# Altium schematic sheet Telephone Line Emulator.SchDoc: Telephone Line Emulator
size A4; Title2: NASCO ALARM INTERFACE
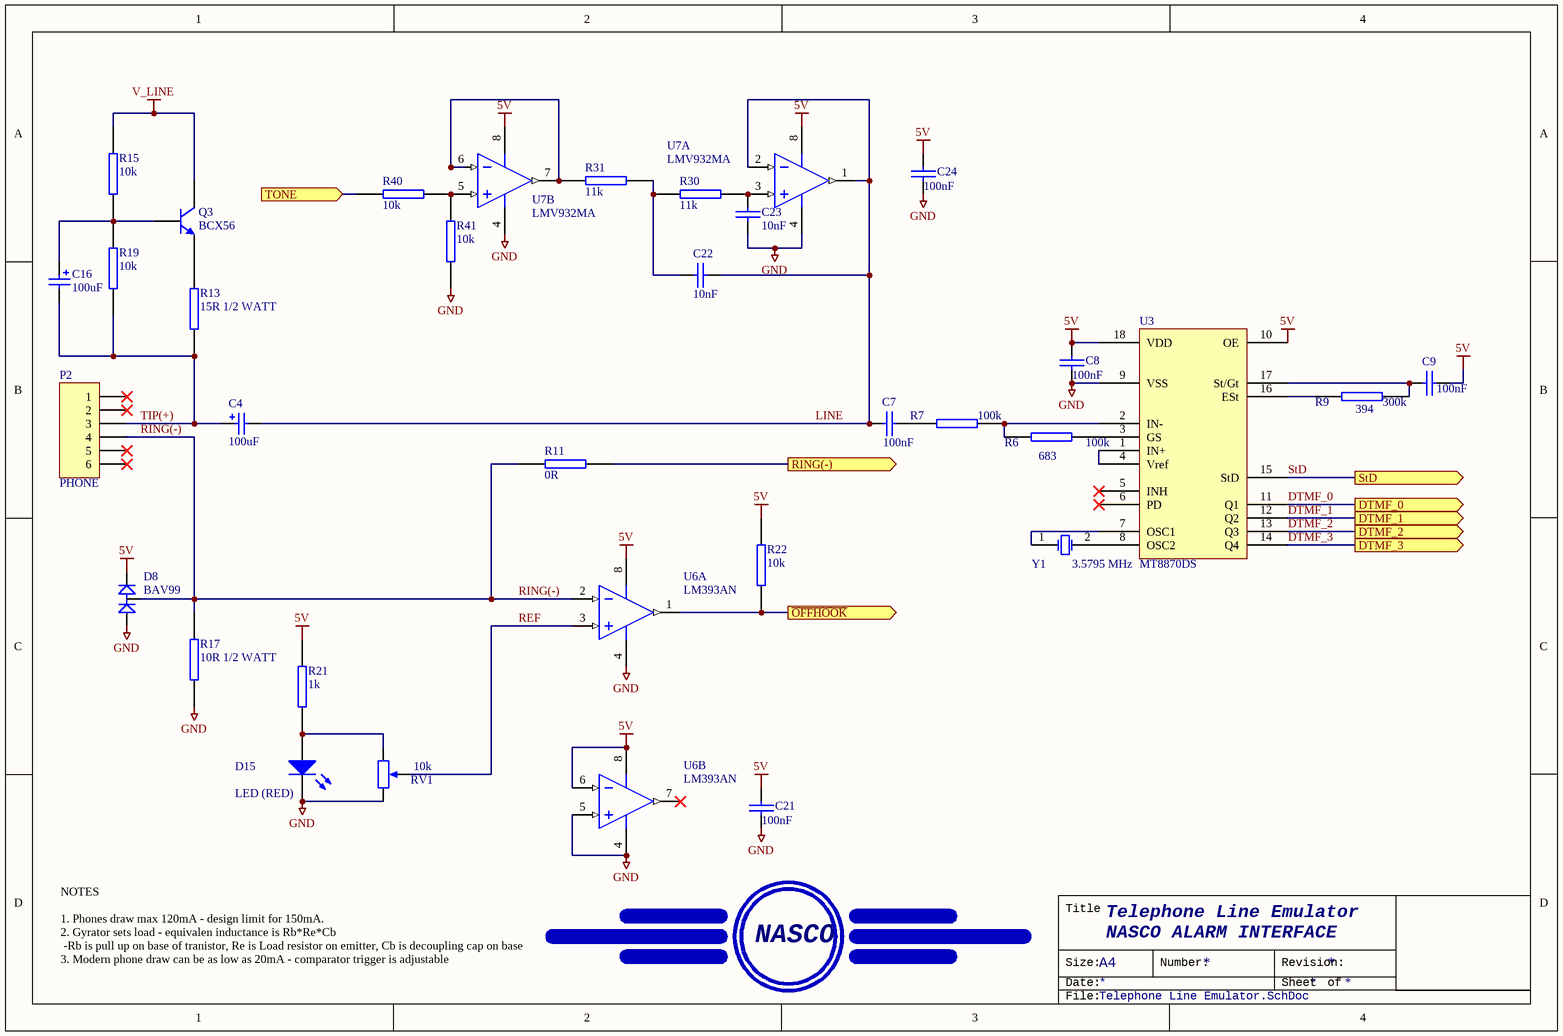
[diagram p0: Telephone Line Emulator.SchDoc]

## Parts
?  (no value)  (no BOM)
C4  100uF  [CAP ELECTRO SIZE-E]
C7  100nF  [CAP (3D) - 0603]
C8  100nF  [CAP (3D) - 0603]
C9  100nF  [CAP (3D) - 0603]
C16  100uF  [CAP ELECTRO SIZE-E]
C21  100nF  [CAP (3D) - 0603]
C22  10nF  [CAP (3D) - 0603]
C23  10nF  [CAP (3D) - 0603]
C24  100nF  [CAP (3D) - 0603]
D8  BAV99  [SOT23-3L]
D15  LED (RED)  [LED 3MM]
P2  PHONE  [MOLEXZ RJ11]
Q3  BCX56  [SOT89]
R6  100k  [RES (3D) - 0603]
R7  100k  [RES (3D) - 0603]
R9  300k  [RES (3D) - 0603]
R11  0R  [RES (3D) - 0603]
R13  15R 1/2 WATT  [RES (3D) - 1210]
R15  10k  [RES (3D) - 0603]
R17  10R 1/2 WATT  [RES (3D) - 1210]
R19  10k  [RES (3D) - 0603]
R21  1k  [RES (3D) - 0603]
R22  10k  [RES (3D) - 0603]
R30  11k  [RES (3D) - 0603]
R31  11k  [RES (3D) - 0603]
R40  10k  [RES (3D) - 0603]
R41  10k  [RES (3D) - 0603]
RV1  10k  [TRIMPOT (10 TURN) - RIGHT ANGLE]
U3  MT8870DS  [SOIC-18]
U6  LM393AN  [SO-8]  (parts A,B of 2)
U7  LMV932MA  [SO-8]  (parts A,B of 2)
Y1  3.5795 MHz  [HC49/4H_SMX]

## Ports
DTMF_0 (out), DTMF_1 (out), DTMF_2 (out), DTMF_3 (out), RING(-) (out), StD (out), TONE (in), ~{OFFHOOK} (out)

## Nets
5V: C8.1 C9.1 C21.1 C24.1 D8.2(C2) R21.2 R22.2 U3.10(OE) U3.18(VDD) U6.6(IN-) U6.8(V+) U7.8(V+)
GND: C8.2 C21.2 C23.2 C24.2 D8.1(A1) D15.2(K) R17.1 R41.1 RV1.3 U3.9(VSS) U6.4(GND) U6.5(IN+) U7.4(GND)
V_LINE: Q3.2(C) R15.2
DTMF_0: U3.11(Q1) ; port DTMF_0
DTMF_1: U3.12(Q2) ; port DTMF_1
DTMF_2: U3.13(Q3) ; port DTMF_2
DTMF_3: U3.14(Q4) ; port DTMF_3
LINE: C4.2 C7.2 C22.2 U7.1(OUTA) U7.2(INA-)
~{OFFHOOK}: R22.1 U6.1(OUT) ; port ~{OFFHOOK}
REF: RV1.2 U6.3(IN+)
RING(-): D8.3(C1/A2) P2.4 R11.1 R17.2 U6.2(IN-)
RING(-): R11.2 ; port RING(-)  [a separate net that carries the same name]
StD: U3.15(StD) ; port StD
TIP(+): C4.1 C16.2 P2.3 R13.1 R19.1
TONE: R40.1 ; port TONE
NetC7_1: C7.1 R7.1
NetC9_2: C9.2 R9.2 U3.17(St/Gt)
NetC16_1: C16.1 Q3.3(B) R15.1 R19.2
NetC22_1: C22.1 R30.1 R31.2
NetC23_1: C23.1 R30.2 U7.3(INA+)
NetD15_1: D15.1(A) R21.1 RV1.1
NetQ3_1: Q3.1(E) R13.2
NetR6_1: R6.1 R7.2 U3.2(IN-)
NetR6_2: R6.2 U3.3(GS)
NetR9_1: R9.1 U3.16(ESt)
NetR31_1: R31.1 U7.6(INB-) U7.7(OUTB)
NetR40_2: R40.2 R41.2 U7.5(INB+)
NetU3_1: U3.1(IN+) U3.4(Vref)
NetU3_7: U3.7(OSC1) Y1.1(OSC1)
NetU3_8: U3.8(OSC2) Y1.2(OSC2)

Not connected (* = marked no-connect by the designer): P2 1* 2* 5* 6*; U3 5(INH)* 6(PD)*; U6 7(OUT)*

## Notes on the sheet
- (near R9) 394
- (near R6) 683
- NOTES
  1. Phones draw max 120mA - design limit for 150mA.
  2. Gyrator sets load - equivalen inductance is Rb*Re*Cb
  -Rb is pull up on base of tranistor, Re is Load resistor on emitter, Cb is decoupling cap on base
  3. Modern phone draw can be as low as 20mA - comparator trigger is adjustable
- Title
- NASCO
- Size:
- Date:
- A4
- Number:
- Revision:
- Sheet
- of
- File:

## Library data of the parts
? = NASCO_LOGO: LOGO
C4 C16 = 100uF 25V ALU E: 100uF 25V; Manufacturer: Cornell Dubilier; Manufacturer Part No.: AVE107M25E16T-F; Mouser Part no.: 598-AVE107M25E16T-F; Web link: http://au.mouser.com/ProductDetail/Cornell-Dubilier/AVE107M25E16T-F/?qs=%2fha2pyFaduhQkIFxhTUYGHjqKtvzDu12YwE1LyhVKKrxkq5U81i5PA%3d%3d; value: 100uF
C7-C9 C21 C24 = CAP: CAPACITOR SMD 0402; Manufacturer: Murata; Manufacturer Part No.: GCM188R71C104KA37D; Value: 100nF; Mouser Part no.: 81-GCM188R71C104KA7D; Web link: http://au.mouser.com/ProductDetail/Murata/GCM188R71C104KA37D/?qs=aEuGZpxfbxWKAxwYn%252beTMg%3d%3d
C22 C23 = CAP SMD 0603 100nF: CAPACITOR SMD 0603; Manufacturer: Murata; Manufacturer Part No.: GCM188R71H103KA37D; value: 10nF; Mouser Part no.: 81-GCM188R71H103KA7D; Web link: http://au.mouser.com/ProductDetail/Murata/GCM188R71H103KA37D/?qs=sGAEpiMZZMvQvaS66kI3TsYN5z8BU0lue524z4jMLFo%3d
D8 = BAV99: DUAL DIODE, BAV99; Manufacturer: FAIRCHILD SEMICONDUCTOR; Mouser Part no.: 771-BAV99/T3; Manufacturer Part No.: BAV99; value: BAV99; Web link: http://au.mouser.com/ProductDetail/NXP-Semiconductors/BAV99-T3/?qs=sGAEpiMZZMtldOIVIVqa3WNg7zlWz8nBhXHsMX6ttIg%3d
D15 = LED 3mm RED: 3mm RED LED; Manufacturer: Lite-On; Manufacturer Part No.: LTL-4261NR; value: RED 3mm; Mouser Part no.: 859-LTL-4261NR; Web link: http://au.mouser.com/ProductDetail/Lite-On/LTL-307E/?qs=sGAEpiMZZMs4quMj8r4lmhnQMFVtnV3yedxNjWAKgTA%3d
P2 = Header 6: Header, 6-Pin; Manufacturer: Molex; Manufacturer Part No.: 43860-0020; Value: RJ12; Mouser Part No.: 538-43860-0020; Web link: http://au.mouser.com/ProductDetail/Molex/43860-0020/?qs=%2fha2pyFaduiNL6xQ0Kh7Hr7w3depcjdzE6sQfTKDcgo%3d
Q3 = BCX56: NPN Bipolar Transistor; Manufacturer: NXP Semiconductors; Manufacturer Part No.: BCX56-16,135; Mouser Part no.: 771-BCX56-16135; value: BCX56; Web link: http://au.mouser.com/ProductDetail/NXP-Semiconductors/BCX56-16135/?qs=sGAEpiMZZMshyDBzk1%2fWi7dklbCN21lX%252bMOhYZE9xSQ%3d
R6 R7 = RES SMD 0603 100R: RESISTOR SMD 0603; Manufacturer: Bourns; Manufacturer Part No.: CR0603-FX-1003HLF; Value: 100k; Mouser Part no.: 652-CR0603-FX1003HLF; Web link: http://au.mouser.com/ProductDetail/Bourns/CR0603-FX-1003HLF/?qs=sGAEpiMZZMtlubZbdhIBIJoX7P5Bll7agPmSg7minrk%3d
R9 = RES SMD 0603 100R: RESISTOR SMD 0603; Manufacturer: Panasonic; Manufacturer Part No.: ERJ-3EKF3003V; Value: 300k; Mouser Part no.: 667-ERJ-3EKF3003V; Web link: http://au.mouser.com/ProductDetail/Panasonic-Electronic-Components/ERJ-3EKF3003V/?qs=sGAEpiMZZMtlubZbdhIBILWcrV%252bWBYJCTyl7GE3YiME%3d
R11 = RES SMD 0603 0R: RESISTOR SMD 0603 0R; Manufacturer: Bourns; Manufacturer Part No.: 301-0-RC; Mouser Part no.: 301-0-RC; Web link: http://au.mouser.com/ProductDetail/Xicon/301-0-RC/?qs=sGAEpiMZZMvdGkrng054t6dxHNVVMN7PUiHPAaTxOFU%3d; value: 0R
R13 = RES SMD 0603 100R: RESISTOR SMD 0603; Manufacturer: Panasonic; Manufacturer Part No.: ERJ-14NF15R0U; Value: 15R 1/2 WATT; Mouser Part No.: 667-ERJ-14NF15R0U; Web link: http://au.mouser.com/ProductDetail/Panasonic/ERJ-14NF15R0U/?qs=%2fha2pyFaduiRtFL%252bUIaHLpkEnPFulQf6Pw3ymSu1pa3%2fVAYEq2%252bQvg%3d%3d
R15 R19 = RES SMD 0603 10k: RESISTOR SMD 0603 10k; Manufacturer: Bourns; Manufacturer Part No.: CR0603FX-1002ELF; Mouser Part no.: 652-CR0603FX-1002ELF; Web link: http://au.mouser.com/Search/Refine.aspx?Keyword=652-CR0603FX-1002ELF; value: 10k
R17 = RES SMD 0603 100R: RESISTOR SMD 0603; Manufacturer: Panasonic; Manufacturer Part No.: ERJ-14NF10R0U; Value: 10R 1/2 WATT; Mouser Part No.: 667-ERJ-14NF10R0U; Web link: http://au.mouser.com/ProductDetail/Panasonic/ERJ-14NF10R0U/?qs=%2fha2pyFaduiRtFL%252bUIaHLhq8AVNX5DKnOm6ct2rZgdY1OTBP5rrjxg%3d%3d
R21 = RES SMD 0603 1k: RESISTOR SMD 0603 1k; Manufacturer: Bourns; Manufacturer Part No.: CR0603-JW-102ELF; Mouser Part no.: 652-CR0603-JW-102ELF; Web link: http://au.mouser.com/ProductDetail/Bourns/CR0603-JW-102ELF/?qs=sGAEpiMZZMu61qfTUdNhG2nPoCjtvs%252bRXTOJv8O9Kbk%3d; value: 1k
R22 = RES SMD 0603 100R: RESISTOR SMD 0603; Manufacturer: Bourns; Manufacturer Part No.: CR0603FX-1002ELF; Value: 10k; Mouser Part no.: 652-CR0603FX-1002ELF; Web link: http://au.mouser.com/Search/Refine.aspx?Keyword=652-CR0603FX-1002ELF
R30 R31 = RES SMD 0603 1k: RESISTOR SMD 0603 1k; Manufacturer: Bourns; Manufacturer Part No.: CR0603FX-1102ELF; Mouser Part no.: 652-CR0603FX-1102ELF; Web link: http://au.mouser.com/ProductDetail/Bourns/CR0603-FX-1102ELF/?qs=sGAEpiMZZMtlubZbdhIBIJoX7P5Bll7awqQ9N9RUQg0%3d; value: 11k
R40 R41 = RES SMD 0603 1k: RESISTOR SMD 0603 1k; Manufacturer: Bourns; Manufacturer Part No.: CR0603FX-1002ELF; Mouser Part no.: 652-CR0603FX-1002ELF; Web link: http://au.mouser.com/Search/Refine.aspx?Keyword=652-CR0603FX-1002ELF; value: 10k
RV1 = VAR (POT) SMD: Variable Resistor; Manufacturer: Bourns; Manufacturer Part No.: CR0603FX-1002ELF; Value: 10k; Mouser Part no.: 652-CR0603FX-1002ELF; Web link: http://au.mouser.com/Search/Refine.aspx?Keyword=652-CR0603FX-1002ELF
U3 = MT8870: MT8870 DTMF DECODER; Manufacturer: Zarlink; Value: MT8870DS; Futurelec Part No.: MT8870DS; Web link: http://www.futurlec.com.au/price1.jsp?part_no=MT8870DS
U6 = LM393AN: Dual Comparator; Manufacturer: Texas Instruments; Manufacturer Part No.: LM393DR; Value: LM393AN; Mouser Part no.: 595-LM393DR; Web link: http://au.mouser.com/ProductDetail/Texas-Instruments/LM393DR/?qs=sGAEpiMZZMtYFXwiBRPs0y0IZDAx48Kf
U7 = LMV932MA/NOPB: Low Power Dual Operational Amplifier, 8-pin Narrow SOIC; Manufacturer: Texas Instruments; Value: LMV932MA; Manufacturer Part No.: LMV932MA/NOPB; Mouser Part no.: 926-LMV932MA/NOPB; Web link: http://au.mouser.com/ProductDetail/Texas-Instruments/LMV932MA-NOPB/?qs=sGAEpiMZZMtCHixnSjNA6M%252bbBaCn4IWbXgUPZoZBrA4%3d
Y1 = XTAL: Crystal Oscillator; Manufacturer: ECS; Manufacturer Part No.: ECS-35-17-5PX-TR; Mouser Part No.: 520-CSM357-17-X; Value: 3.5795 MHz; Web link: http://au.mouser.com/ProductDetail/ECS/ECS-35-17-5PX-TR/?qs=sGAEpiMZZMukHu%252bjC5l7YSPb5QW3X1l0%2fsW5L67T75c%3d